# Altium project PCB_Projectsoldeerbout.PrjPcb
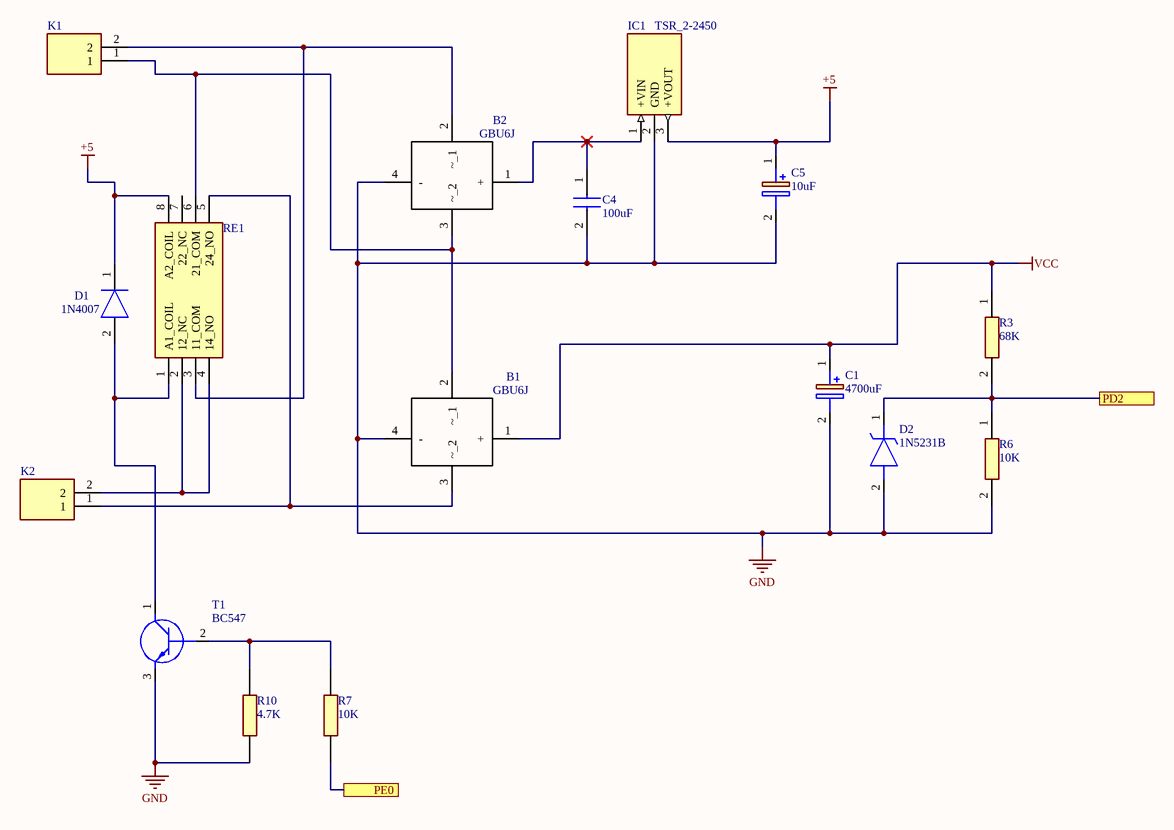
[diagram p0: Soldeerbout_P1.SchDoc]
5 sheets, 73 parts. Net scope: flat (ports and power ports of the same name join across sheets).
Board file: PCB1.PcbDoc
Sheets:
  Soldeerbout_P1.SchDoc
  Soldeerbout_P2.SchDoc
  Soldeerbout_P3.SchDoc
  Soldeerbout_P4.SchDoc
  Soldeerbout_P5.SchDoc

## Sheet Soldeerbout_P1.SchDoc: Soldeerbout
size A4; DrawnBy: Boghe Tim; Revision: 01; SheetNumber: 1; SheetTotal: 5; Number: PXL2022-0001

### Parts
B1  GBU6J  [B1,2 GBU6J 600V 6 A]
B2  GBU6J  [B1,2 GBU6J 600V 6 A]
C1  4700uF  [C 50V 4700uF]
C4  100uF  [CAPPRD350W52D800H1300]
C5  10uF  [C 50V 10µF]
D1  1N4007  [1N4007]
D2  1N5231B  [1N5231B 5.1V 0.5W]
IC1  TSR_2-2450  [IC1 TSR-2]
K1  (no value)  [K printkroonsteen 5.08]
K2  (no value)  [K printkroonsteen 5.08]
R3  68K  [0805]
R6  10K  [0805]
R7  10K  [0805]
R10  4.7K  [0805]
RE1  5 VDC 8A  [relais 5V 8A]  (value not drawn)
T1  BC547  [T1,2,4 BC547C 45V 100mA]

### Ports
PD2, PE0

### Nets
+5: C5.1(+) D1.1(K) IC1.3(+VOUT) RE1.8(A2_COIL)
GND: B1.4(-) B2.4(-) C1.2(-) C4.2(-) C5.2(-) D2.2(A) IC1.2(GND) R6.2 R10.2 T1.3(E)
VCC: B1.1(+) C1.1(+) R3.1
NetB1_2: B1.2(~_1) B2.3(~_2) K1.1 RE1.6(21_COM)
NetB1_3: B1.3(~_2) K2.1 RE1.5(24_NO)
NetB2_1: B2.1(+) C4.1(+) IC1.1(+VIN)
NetB2_2: B2.2(~_1) K1.2 RE1.3(11_COM)
NetD1_2: D1.2(A) RE1.1(A1_COIL) T1.1(C)
NetD2_1: D2.1(K) R3.2 R6.1 ; port PD2
NetIC3_19: R7.2 ; port PE0
NetK2_2: K2.2 RE1.2(12_NC) RE1.4(14_NO)
NetR7_1: R7.1 R10.1 T1.2(B)

Not connected (* = marked no-connect by the designer): RE1 7(22_NC)

### Library data of the parts
B1 B2 = GBU6J: Bridge Rectifier; Manufacturer_Name: GeneSiC Semiconductor; Datasheet Link: https://www.diodemodule.com/silicon_products/bridge_rectifiers/gbu6j.pdf; Height: 18.8mm; Manufacturer_Part_Number: GBU6J
C1 = ESK478M050AQ3AA: Capacitor Polarised; Manufacturer_Name: Kemet; Datasheet Link: https://componentsearchengine.com//ESK478M050AQ3AA.pdf; Height: 37mm; Mouser2 Part Number: 80-ESK478M050AQ3AA; Mouser2 Price/Stock: https://www.mouser.com/Search/Refine.aspx?Keyword=80-ESK478M050AQ3AA; Manufacturer_Part_Number: ESK478M050AQ3AA
C4 = 860020674015: Capacitor; Manufacturer_Name: Wurth Elektronik; Datasheet Link: https://www.we-online.com/catalog/datasheet/860020674015.pdf; Height: 13mm; Manufacturer_Part_Number: 860020674015
C5 = ESS106M050AE2AA: Capacitor Polarised; Manufacturer_Name: Kemet; Datasheet Link: https://content.kemet.com/datasheets/KEM_A4057_ESS.pdf; Height: 8.5mm; Manufacturer_Part_Number: ESS106M050AE2AA
D1 = RL1N4007-T: Diode; Manufacturer_Name: Rectron; Datasheet Link: https://www.mouser.in/datasheet/2/345/rl1n4001-rl1n4007-35989.pdf; Manufacturer_Part_Number: RL1N4007-T
D2 = 1N5231B: Zener Diode; Manufacturer_Name: ON Semiconductor; Manufacturer_Part_Number: 1N5231B
IC1 = TSR_2-2450: Power Supply; Manufacturer_Name: Traco Power; Manufacturer_Part_Number: TSR 2-2450; Datasheet Link: https://componentsearchengine.com//TSR 2-2450.pdf; Mouser2 Part Number: 495-TSR2-2450; Mouser2 Price/Stock: https://www.mouser.com/Search/Refine.aspx?Keyword=495-TSR2-2450
K1 K2 = TB007-508-02BE: Connector; Manufacturer_Name: CUI Inc.; Datasheet Link: https://componentsearchengine.com//TB007-508-02BE.pdf; Height: 14mm; Mouser2 Part Number: 490-TB007-508-02BE; Mouser2 Price/Stock: https://www.mouser.com/Search/Refine.aspx?Keyword=490-TB007-508-02BE; Manufacturer_Part_Number: TB007-508-02BE
R3 R6 R7 R10 = ESR10EZPJ183: Resistor; Manufacturer_Name: ROHM Semiconductor; Datasheet Link: https://datasheet.datasheetarchive.com/originals/distributors/Datasheets_SAMA/30ccb516c688c96e56c83a00b77a93f4.pdf; Height: 0.65mm; Manufacturer_Part_Number: ESR10EZPJ183
RE1 = RT424005: Relay or Contactor; Manufacturer_Name: TE Connectivity; Datasheet Link: https://componentsearchengine.com//RT424005.pdf; Mouser2 Part Number: 655-RT424005; Mouser2 Price/Stock: https://www.mouser.com/Search/Refine.aspx?Keyword=655-RT424005; Manufacturer_Part_Number: RT424005
T1 = BC547CBU: Transistor BJT NPN; Manufacturer_Name: ON Semiconductor; Datasheet Link: https://www.onsemi.com/pdf/datasheet/bc550-d.pdf; Height: 5.33mm; Manufacturer_Part_Number: BC547CBU

## Sheet Soldeerbout_P2.SchDoc: Soldeerbout
size A4; DrawnBy: Boghe Tim; Revision: 01; SheetNumber: 2; SheetTotal: 5; Number: PXL2022-0001
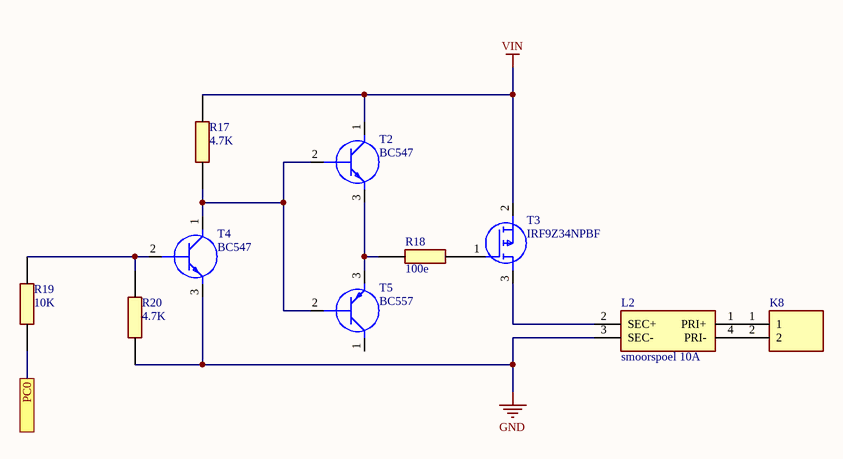
[diagram p1: Soldeerbout_P2.SchDoc]

### Parts
K8  (no value)  [K printkroonsteen 5.08]
L2  smoorspoel 10A  [CM smoorspoelen/filters 170ohm 100Mhz 10A]
R17  4.7K  [0805]
R18  100e  [0805]
R19  10K  [0805]
R20  4.7K  [0805]
T2  BC547  [T1,2,4 BC547C 45V 100mA]
T3  IRF9Z34NPBF  [T3 P-mosfet 55V 17A 0.1e]
T4  BC547  [T1,2,4 BC547C 45V 100mA]
T5  BC557  [BC557C T5 45V 100mA]

### Ports
PC0

### Nets
GND: L2.3(SEC-) R20.2 T4.3(E)
VIN: R17.1 T2.1(C) T3.2(S)
NetIC3_1: R19.2 ; port PC0
NetK8_1: K8.1 L2.1(PRI+)
NetK8_2: K8.2 L2.4(PRI-)
NetL2_2: L2.2(SEC+) T3.3(D)
NetR17_2: R17.2 T2.2(B) T4.1(C) T5.2(B)
NetR18_1: R18.1 T2.3(E) T5.3(E)
NetR18_2: R18.2 T3.1(G)
NetR19_1: R19.1 R20.1 T4.2(B)

Not connected (* = marked no-connect by the designer): T5 1(C)

### Library data of the parts
K8 = TB007-508-02BE: Connector; Manufacturer_Name: CUI Inc.; Datasheet Link: https://componentsearchengine.com//TB007-508-02BE.pdf; Height: 14mm; Mouser2 Part Number: 490-TB007-508-02BE; Mouser2 Price/Stock: https://www.mouser.com/Search/Refine.aspx?Keyword=490-TB007-508-02BE; Manufacturer_Part_Number: TB007-508-02BE
L2 = CM2545X171B-10: Transformer; Manufacturer_Name: Laird Technologies; Datasheet Link: https://datasheet.datasheetarchive.com/originals/dk/DKDS-7/122753.pdf; Height: 9.5mm; Manufacturer_Part_Number: CM2545X171B-10
R17-R20 = ESR10EZPJ183: as R3 on sheet Soldeerbout_P1; Datasheet Link: https://datasheet.datasheetarchive.com/originals/distributors/Datasheets_SAMA/30ccb516c688c96e56c83a00b77a93f4.pdf; Height: 0.65mm; Manufacturer_Part_Number: ESR10EZPJ183
T2 T4 = BC547CBU: as T1 on sheet Soldeerbout_P1; Datasheet Link: https://www.onsemi.com/pdf/datasheet/bc550-d.pdf; Height: 5.33mm; Manufacturer_Part_Number: BC547CBU
T3 = IRF9Z34NPBF: MOSFET (P-Channel); Manufacturer_Name: Infineon; Datasheet Link: https://componentsearchengine.com//IRF9Z34NPBF.pdf; Height: 4.69mm; Mouser2 Part Number: 942-IRF9Z34NPBF; Mouser2 Price/Stock: https://www.mouser.com/Search/Refine.aspx?Keyword=942-IRF9Z34NPBF; Manufacturer_Part_Number: IRF9Z34NPBF
T5 = BC557ATA: Transistor BJT PNP; Manufacturer_Name: ON Semiconductor; Datasheet Link: https://componentsearchengine.com//BC557ATA.pdf; Mouser2 Part Number: 512-BC557ATA; Mouser2 Price/Stock: https://www.mouser.com/Search/Refine.aspx?Keyword=512-BC557ATA; Manufacturer_Part_Number: BC557ATA

## Sheet Soldeerbout_P3.SchDoc: Soldeerbout
size A4; DrawnBy: Boghe Tim; Revision: 01; SheetNumber: 3; SheetTotal: 5; Number: PXL2022-0001
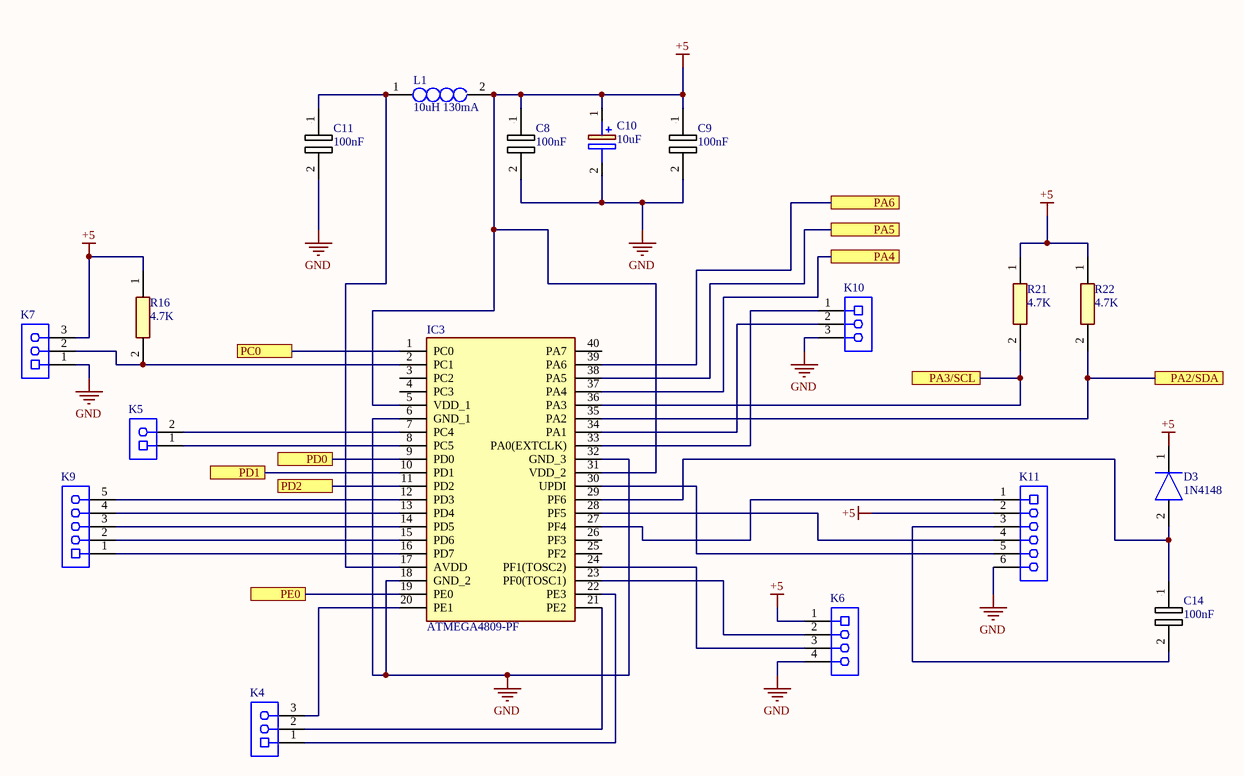
[diagram p2: Soldeerbout_P3.SchDoc]

### Parts
C8  100nF  [0805]
C9  100nF  [0805]
C10  10uF  [C 50V 10µF]
C11  100nF  [0805]
C14  100nF  [0805]
D3  1N4148  [1N4148, 100V 200mA]
IC3  ATMEGA4809-PF  [ic3]
K4  61300311821  [61300311821]  (value not drawn)
K5  61300211821  [61300211821]  (value not drawn)
K6  61300411821  [61300411821]  (value not drawn)
K7  61300311821  [61300311821]  (value not drawn)
K9  61300511821  [61300511821]  (value not drawn)
K10  61300311821  [61300311821]  (value not drawn)
K11  61300611821  [61300611821]  (value not drawn)
L1  10uH 130mA  [L1 10uH 130mA]
R16  4.7K  [0805]
R21  4.7K  [0805]
R22  4.7K  [0805]

### Ports
PA2/SDA, PA3/SCL, PA4, PA5, PA6, PC0, PD0, PD1, PD2, PE0

### Nets
+5: C8.1 C9.1 C10.1(+) D3.1(K) IC3.5(VDD_1) IC3.31(VDD_2) K6.1 K7.3 K11.2 L1.2 R16.1 R21.1 R22.1
GND: C8.2 C9.2 C10.2(-) C11.2 IC3.6(GND_1) IC3.18(GND_2) IC3.32(GND_3) K6.4 K7.1 K10.3 K11.6
NetC3d_1: IC3.38(PA5) ; port PA5
NetC4d_1: IC3.39(PA6) ; port PA6
NetC5d_1: IC3.37(PA4) ; port PA4
NetC6_1: IC3.9(PD0) ; port PD0
NetC11_1: C11.1 IC3.17(AVDD) L1.1
NetC12_1: IC3.10(PD1) ; port PD1
NetC14_1: C14.1 D3.2(A) IC3.29(PF6)
NetC14_2: C14.2 K11.3
NetD2_1: IC3.11(PD2) ; port PD2
NetIC3_1: IC3.1(PC0) ; port PC0
NetIC3_2: IC3.2(PC1) K7.2 R16.2
NetIC3_7: IC3.7(PC4) K5.2
NetIC3_8: IC3.8(PC5) K5.1
NetIC3_12: IC3.12(PD3) K9.5
NetIC3_13: IC3.13(PD4) K9.4
NetIC3_14: IC3.14(PD5) K9.3
NetIC3_15: IC3.15(PD6) K9.2
NetIC3_16: IC3.16(PD7) K9.1
NetIC3_19: IC3.19(PE0) ; port PE0
NetIC3_20: IC3.20(PE1) K4.3
NetIC3_21: IC3.21(PE2) K4.2
NetIC3_22: IC3.22(PE3) K4.1
NetIC3_23: IC3.23(PF0(TOSC1)) K6.2
NetIC3_24: IC3.24(PF1(TOSC2)) K6.3
NetIC3_27: IC3.27(PF4) K11.1
NetIC3_28: IC3.28(PF5) K11.4
NetIC3_30: IC3.30(UPDI) K11.5
NetIC3_33: IC3.33(PA0(EXTCLK)) K10.1
NetIC3_34: IC3.34(PA1) K10.2
NetIC3_35: IC3.35(PA2) R22.2 ; port PA2/SDA
NetIC3_36: IC3.36(PA3) R21.2 ; port PA3/SCL

Not connected (* = marked no-connect by the designer): IC3 3(PC2) 4(PC3) 25(PF2) 26(PF3) 40(PA7)

### Library data of the parts
C8 C9 C11 C14 = ESR10EZPJ183_1: Resistor; Manufacturer_Name: ROHM Semiconductor; Datasheet Link: https://datasheet.datasheetarchive.com/originals/distributors/Datasheets_SAMA/30ccb516c688c96e56c83a00b77a93f4.pdf; Height: 0.65mm; Manufacturer_Part_Number: ESR10EZPJ183
C10 = ESS106M050AE2AA: as C5 on sheet Soldeerbout_P1; Datasheet Link: https://content.kemet.com/datasheets/KEM_A4057_ESS.pdf; Height: 8.5mm; Manufacturer_Part_Number: ESS106M050AE2AA
D3 = 1N4148: Diode; Manufacturer_Name: Nexperia; Datasheet Link: https://datasheet.datasheetarchive.com/originals/distributors/Datasheets-112/DSAP0040891.pdf; Manufacturer_Part_Number: 1N4148
IC3 = ATMEGA4809-PF: Integrated Circuit; Manufacturer_Name: Microchip; Datasheet Link: https://componentsearchengine.com//ATMEGA4809-PF.pdf; Height: 6.35mm; Mouser2 Part Number: 556-ATMEGA4809-PF; Mouser2 Price/Stock: https://www.mouser.com/Search/Refine.aspx?Keyword=556-ATMEGA4809-PF; Manufacturer_Part_Number: ATMEGA4809-PF
K4 K7 K10 = 61300311821: WR-PHD Socket Header, THT, pitch 2.54mm, Single Row, Vertical, 3p; Manufacturer: Wurth Elektronik; Pin Number: 3; Rated Current: 3A; Working Voltage: 250VAC; Withstanding Voltage: 500VAC; Contact Resistance: 20mOhm; ComponentLink1Description: Manufacturer; ComponentLink1URL: http://www.we-online.de; ComponentLink2Description: Datasheet; ComponentLink2URL: https://www.we-online.com/catalog/datasheet/61300311821.pdf; Manufacturer Part Number: 61300311821; Pitch: 2.54mm; Operating Temperature: -40 to +125degC; Mounting Technology: THT; Packaging: Tray; Gender: Socket Header; Row Number: Single; Orientation: Vertical
K5 = 61300211821: WR-PHD Socket Header, THT, pitch 2.54mm, Single Row, Vertical, 2p; Manufacturer: Wurth Elektronik; Pin Number: 2; Rated Current: 3A; Working Voltage: 250VAC; Withstanding Voltage: 500VAC; Contact Resistance: 20mOhm; ComponentLink1Description: Manufacturer; ComponentLink1URL: http://www.we-online.de; ComponentLink2Description: Datasheet; ComponentLink2URL: https://www.we-online.com/catalog/datasheet/61300211821.pdf; Manufacturer Part Number: 61300211821; Pitch: 2.54mm; Operating Temperature: -40 to +125degC; Mounting Technology: THT; Packaging: Tray; Gender: Socket Header; Row Number: Single; Orientation: Vertical
K6 = 61300411821: WR-PHD Socket Header, THT, pitch 2.54mm, Single Row, Vertical, 4p; Manufacturer: Wurth Elektronik; Pin Number: 4; Rated Current: 3A; Working Voltage: 250VAC; Withstanding Voltage: 500VAC; Contact Resistance: 20mOhm; ComponentLink1Description: Manufacturer; ComponentLink1URL: http://www.we-online.de; ComponentLink2Description: Datasheet; ComponentLink2URL: https://www.we-online.com/catalog/datasheet/61300411821.pdf; Manufacturer Part Number: 61300411821; Pitch: 2.54mm; Operating Temperature: -40 to +125degC; Mounting Technology: THT; Packaging: Tray; Gender: Socket Header; Row Number: Single; Orientation: Vertical
K9 = 61300511821: WR-PHD Socket Header, THT, pitch 2.54mm, Single Row, Vertical, 5p; Manufacturer: Wurth Elektronik; Pin Number: 5; Rated Current: 3A; Working Voltage: 250VAC; Withstanding Voltage: 500VAC; Contact Resistance: 20mOhm; ComponentLink1Description: Manufacturer; ComponentLink1URL: http://www.we-online.de; ComponentLink2Description: Datasheet; ComponentLink2URL: https://www.we-online.com/catalog/datasheet/61300511821.pdf; Manufacturer Part Number: 61300511821; Pitch: 2.54mm; Operating Temperature: -40 to +125degC; Mounting Technology: THT; Packaging: Tray; Gender: Socket Header; Row Number: Single; Orientation: Vertical
K11 = 61300611821: WR-PHD Socket Header, THT, pitch 2.54mm, Single Row, Vertical, 6p; Manufacturer: Wurth Elektronik; Pin Number: 6; Rated Current: 3A; Working Voltage: 250VAC; Withstanding Voltage: 500VAC; Contact Resistance: 20mOhm; ComponentLink1Description: Manufacturer; ComponentLink1URL: http://www.we-online.de; ComponentLink2Description: Datasheet; ComponentLink2URL: https://www.we-online.com/catalog/datasheet/61300611821.pdf; Manufacturer Part Number: 61300611821; Pitch: 2.54mm; Operating Temperature: -40 to +125degC; Mounting Technology: THT; Packaging: Tray; Gender: Socket Header; Row Number: Single; Orientation: Vertical
L1 = 78F100J-RC: Inductor; Manufacturer_Name: Bourns; Datasheet Link: https://componentsearchengine.com//78F100J-RC.pdf; Mouser2 Part Number: 542-78F100-RC; Mouser2 Price/Stock: https://www.mouser.com/Search/Refine.aspx?Keyword=542-78F100-RC; Manufacturer_Part_Number: 78F100J-RC
R16 R21 R22 = ESR10EZPJ183: as R3 on sheet Soldeerbout_P1; Datasheet Link: https://datasheet.datasheetarchive.com/originals/distributors/Datasheets_SAMA/30ccb516c688c96e56c83a00b77a93f4.pdf; Height: 0.65mm; Manufacturer_Part_Number: ESR10EZPJ183

## Sheet Soldeerbout_P4.SchDoc: Soldeerbout
size A4; DrawnBy: Boghe Tim; Revision: 01; SheetNumber: 4; SheetTotal: 5; Number: PXL2022-0001
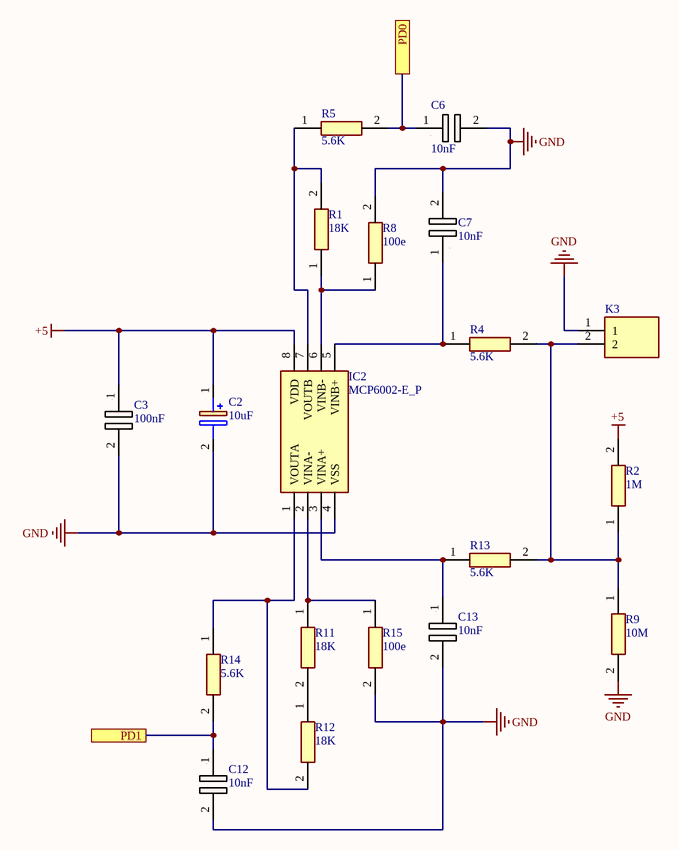
[diagram p3: Soldeerbout_P4.SchDoc]

### Parts
C2  10uF  [C 50V 10µF]
C3  100nF  [0805]
C6  10nF  [0805]
C7  10nF  [0805]
C12  10nF  [0805]
C13  10nF  [0805]
IC2  MCP6002-E_P  [IC2 dual opamp]
K3  TB007-508-02BE  [K printkroonsteen 5.08]  (value not drawn)
R1  18K  [0805]
R2  1M  [0805]
R4  5.6K  [0805]
R5  5.6K  [0805]
R8  100e  [0805]
R9  10M  [0805]
R11  18K  [0805]
R12  18K  [0805]
R13  5.6K  [0805]
R14  5.6K  [0805]
R15  100e  [0805]

### Ports
PD0, PD1

### Nets
+5: C2.1(+) C3.1 IC2.8(VDD) R2.2
GND: C2.2(-) C3.2 C6.2 C7.2 C12.2 C13.2 IC2.4(VSS) K3.1 R8.2 R9.2 R15.2
NetC6_1: C6.1 R5.2 ; port PD0
NetC7_1: C7.1 IC2.5(VINB+) R4.1
NetC12_1: C12.1 R14.2 ; port PD1
NetC13_1: C13.1 IC2.3(VINA+) R13.1
NetIC2_1: IC2.1(VOUTA) R12.2 R14.1
NetIC2_2: IC2.2(VINA-) R11.1 R15.1
NetIC2_6: IC2.6(VINB-) R1.1 R8.1
NetIC2_7: IC2.7(VOUTB) R1.2 R5.1
NetK3_2: K3.2 R2.1 R4.2 R9.1 R13.2
NetR11_2: R11.2 R12.1

### Library data of the parts
C2 = ESS106M050AE2AA: as C5 on sheet Soldeerbout_P1; Datasheet Link: https://content.kemet.com/datasheets/KEM_A4057_ESS.pdf; Height: 8.5mm; Manufacturer_Part_Number: ESS106M050AE2AA
C3 C6 C7 C12 C13 = ESR10EZPJ183_1: as C8 on sheet Soldeerbout_P3; Datasheet Link: https://datasheet.datasheetarchive.com/originals/distributors/Datasheets_SAMA/30ccb516c688c96e56c83a00b77a93f4.pdf; Height: 0.65mm; Manufacturer_Part_Number: ESR10EZPJ183
IC2 = MCP6002-E_P: Integrated Circuit; Manufacturer_Name: Microchip; Manufacturer_Part_Number: MCP6002-E/P; Datasheet Link: https://componentsearchengine.com//MCP6002-E_P.pdf; Height: 5.334mm; Mouser2 Part Number: 579-MCP6002-E/P; Mouser2 Price/Stock: https://www.mouser.com/Search/Refine.aspx?Keyword=579-MCP6002-E%2FP
K3 = TB007-508-02BE: Connector; Manufacturer_Name: CUI Inc.; Datasheet Link: https://componentsearchengine.com//TB007-508-02BE.pdf; Height: 14mm; Mouser2 Part Number: 490-TB007-508-02BE; Mouser2 Price/Stock: https://www.mouser.com/Search/Refine.aspx?Keyword=490-TB007-508-02BE; Manufacturer_Part_Number: TB007-508-02BE
R1 R2 R4 R5 R8 R9 R11-R15 = ESR10EZPJ183: as R3 on sheet Soldeerbout_P1; Datasheet Link: https://datasheet.datasheetarchive.com/originals/distributors/Datasheets_SAMA/30ccb516c688c96e56c83a00b77a93f4.pdf; Height: 0.65mm; Manufacturer_Part_Number: ESR10EZPJ183

## Sheet Soldeerbout_P5.SchDoc: Soldeerbout
size A4; DrawnBy: Boghe Tim; Revision: 01; SheetNumber: 5; SheetTotal: 5; Number: PXL2022-0001
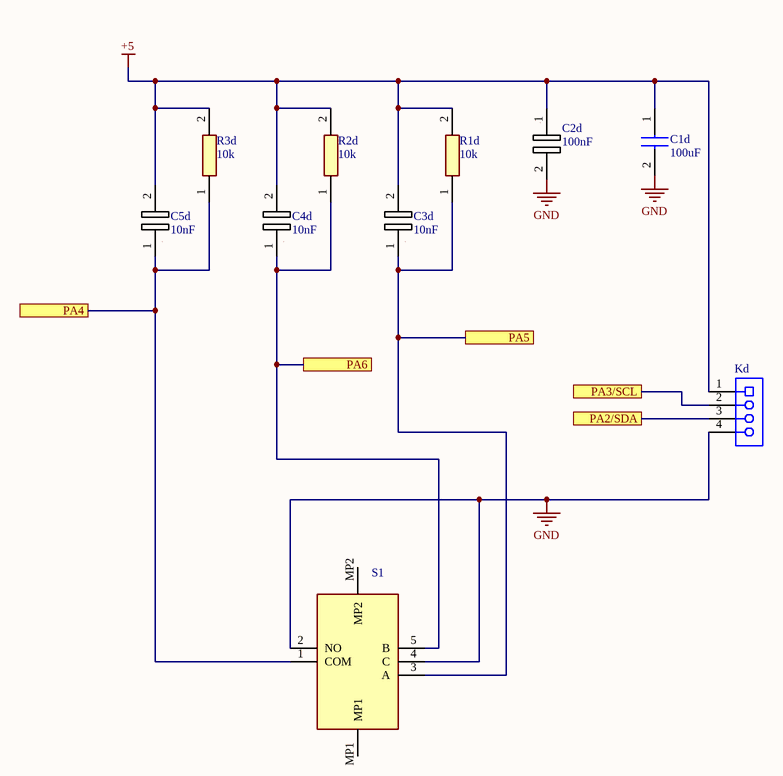
[diagram p4: Soldeerbout_P5.SchDoc]

### Parts
C1d  100uF  [CAPPRD350W52D800H1300]
C2d  100nF  [0805]
C3d  10nF  [0805]
C4d  10nF  [0805]
C5d  10nF  [0805]
Kd  61300411821  [61300411821]  (value not drawn)
R1d  10k  [0805]
R2d  10k  [0805]
R3d  10k  [0805]
S1  482016514001  [482016514001]  (value not drawn)

### Ports
PA2/SDA, PA3/SCL, PA4, PA5, PA6

### Nets
+5: C1d.1(+) C2d.1 C3d.2 C4d.2 C5d.2 Kd.1 R1d.2 R2d.2 R3d.2
GND: C1d.2(-) C2d.2 Kd.4 S1.2(NO) S1.4(C)
NetC3d_1: C3d.1 R1d.1 S1.3(A) ; port PA5
NetC4d_1: C4d.1 R2d.1 S1.5(B) ; port PA6
NetC5d_1: C5d.1 R3d.1 S1.1(COM) ; port PA4
NetIC3_35: Kd.3 ; port PA2/SDA
NetIC3_36: Kd.2 ; port PA3/SCL

Not connected (* = marked no-connect by the designer): S1 MP1 MP2

### Library data of the parts
C1d = 860020674015: as C4 on sheet Soldeerbout_P1; Datasheet Link: https://www.we-online.com/catalog/datasheet/860020674015.pdf; Height: 13mm; Manufacturer_Part_Number: 860020674015
C2d C3d C4d C5d = ESR10EZPJ183_1: as C8 on sheet Soldeerbout_P3; Datasheet Link: https://datasheet.datasheetarchive.com/originals/distributors/Datasheets_SAMA/30ccb516c688c96e56c83a00b77a93f4.pdf; Height: 0.65mm; Manufacturer_Part_Number: ESR10EZPJ183
Kd = 61300411821: as K6 on sheet Soldeerbout_P3; ComponentLink1Description: Manufacturer; ComponentLink1URL: http://www.we-online.de; ComponentLink2Description: Datasheet; ComponentLink2URL: https://www.we-online.com/catalog/datasheet/61300411821.pdf; Manufacturer Part Number: 61300411821; Pitch: 2.54mm; Operating Temperature: -40 to +125degC; Mounting Technology: THT; Packaging: Tray; Gender: Socket Header; Row Number: Single; Orientation: Vertical
R1d R2d R3d = ESR10EZPJ183: as R3 on sheet Soldeerbout_P1; Datasheet Link: https://datasheet.datasheetarchive.com/originals/distributors/Datasheets_SAMA/30ccb516c688c96e56c83a00b77a93f4.pdf; Height: 0.65mm; Manufacturer_Part_Number: ESR10EZPJ183
S1 = 482016514001: Switch; Manufacturer_Name: Wurth Elektronik; Datasheet Link: https://componentsearchengine.com//482016514001.pdf; Height: 26.9mm; Mouser2 Part Number: 710-482016514001; Mouser2 Price/Stock: https://www.mouser.com/Search/Refine.aspx?Keyword=710-482016514001; Manufacturer_Part_Number: 482016514001

## Nets that join several sheets
+5: Soldeerbout_P1 (C5.1 D1.1 IC1.3 RE1.8), Soldeerbout_P3 (13 pins), Soldeerbout_P4 (C2.1 C3.1 IC2.8 R2.2), Soldeerbout_P5 (9 pins)
GND: Soldeerbout_P1 (10 pins), Soldeerbout_P2 (L2.3 R20.2 T4.3), Soldeerbout_P3 (11 pins), Soldeerbout_P4 (11 pins), Soldeerbout_P5 (5 pins)
NetC3d_1: Soldeerbout_P3 (IC3.38), Soldeerbout_P5 (C3d.1 R1d.1 S1.3)
NetC4d_1: Soldeerbout_P3 (IC3.39), Soldeerbout_P5 (C4d.1 R2d.1 S1.5)
NetC5d_1: Soldeerbout_P3 (IC3.37), Soldeerbout_P5 (C5d.1 R3d.1 S1.1)
NetC6_1: Soldeerbout_P3 (IC3.9), Soldeerbout_P4 (C6.1 R5.2)
NetC12_1: Soldeerbout_P3 (IC3.10), Soldeerbout_P4 (C12.1 R14.2)
NetD2_1: Soldeerbout_P1 (D2.1 R3.2 R6.1), Soldeerbout_P3 (IC3.11)
NetIC3_1: Soldeerbout_P2 (R19.2), Soldeerbout_P3 (IC3.1)
NetIC3_19: Soldeerbout_P1 (R7.2), Soldeerbout_P3 (IC3.19)
NetIC3_35: Soldeerbout_P3 (IC3.35 R22.2), Soldeerbout_P5 (Kd.3)
NetIC3_36: Soldeerbout_P3 (IC3.36 R21.2), Soldeerbout_P5 (Kd.2)